# Altium schematic sheet Sheet1.SchDoc
size A
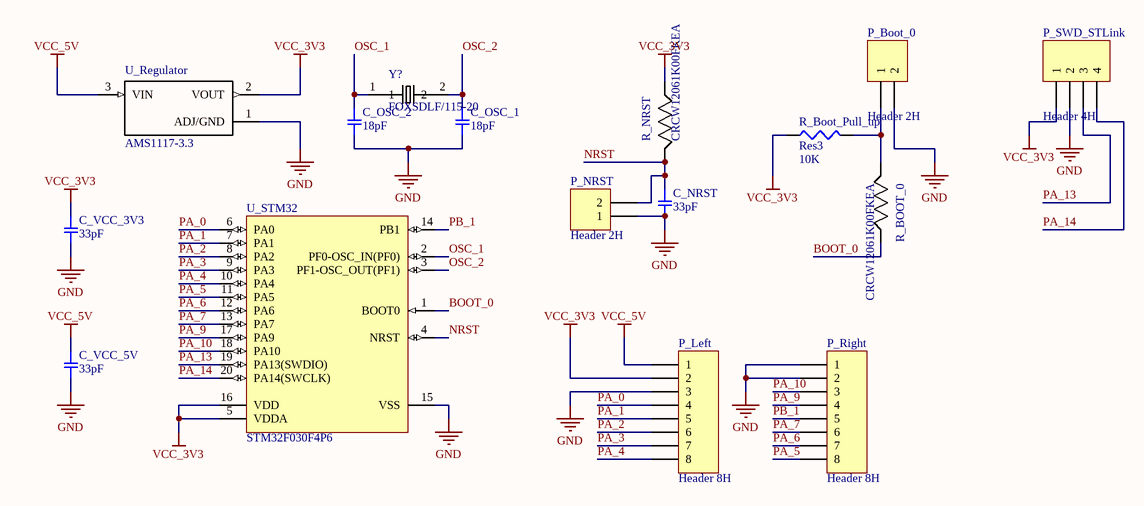
[diagram p0: Sheet1.SchDoc]

## Parts
C_NRST  33pF  [SMD-1206C]
C_OSC_1  18pF  [SMD-1206C]
C_OSC_2  18pF  [SMD-1206C]
C_VCC_3V3  33pF  [SMD-1206C]
C_VCC_5V  33pF  [SMD-1206C]
P_Boot_0  Header 2H  [HDR1X2H]
P_Left  Header 8H  [HDR1X8H]
P_NRST  Header 2H  [HDR1X2H]
P_Right  Header 8H  [HDR1X8H]
P_SWD_STLink  Header 4H  [HDR1X4H]
R_BOOT_0  CRCW12061K00FKEA  [RESC3216X65]
R_Boot_Pull_up  Res3  value 10K  [J1-0603]
R_NRST  CRCW12061K00FKEA  [RESC3216X65]
U_Regulator  AMS1117-3.3  [SOT229P700X180-4N]
U_STM32  STM32F030F4P6  [STM-TSSOP20_N]
Y?  FOXSDLF/115-20  [XTAL1170X500X450]

## Nets
GND: C_NRST.2 C_OSC_1.2 C_OSC_2.2 C_VCC_3V3.2 C_VCC_5V.2 P_Boot_0.2 P_Left.3 P_NRST.1 P_Right.1 P_Right.2 P_SWD_STLink.2 U_Regulator.1(ADJ/GND) U_STM32.15(VSS)
VCC_3V3: C_VCC_3V3.1 P_Left.2 P_SWD_STLink.1 R_Boot_Pull_up.1 R_NRST.2 U_Regulator.2(VOUT) U_STM32.5(VDDA) U_STM32.16(VDD)
VCC_5V: C_VCC_5V.1 P_Left.1 U_Regulator.3(VIN)
BOOT_0: R_BOOT_0.2 U_STM32.1(BOOT0)
NRST: C_NRST.1 P_NRST.2 R_NRST.1 U_STM32.4(NRST)
OSC_1: C_OSC_2.1 U_STM32.2(PF0-OSC_IN(PF0)) Y?.1
OSC_2: C_OSC_1.1 U_STM32.3(PF1-OSC_OUT(PF1)) Y?.2
PA_0: P_Left.4 U_STM32.6(PA0)
PA_1: P_Left.5 U_STM32.7(PA1)
PA_2: P_Left.6 U_STM32.8(PA2)
PA_3: P_Left.7 U_STM32.9(PA3)
PA_4: P_Left.8 U_STM32.10(PA4)
PA_5: P_Right.8 U_STM32.11(PA5)
PA_6: P_Right.7 U_STM32.12(PA6)
PA_7: P_Right.6 U_STM32.13(PA7)
PA_9: P_Right.4 U_STM32.17(PA9)
PA_10: P_Right.3 U_STM32.18(PA10)
PA_13: P_SWD_STLink.3 U_STM32.19(PA13(SWDIO))
PA_14: P_SWD_STLink.4 U_STM32.20(PA14(SWCLK))
PB_1: P_Right.5 U_STM32.14(PB1)
NetP_Boot_0_1: P_Boot_0.1 R_BOOT_0.1 R_Boot_Pull_up.2

## Library data of the parts
C_NRST C_OSC_1 C_OSC_2 C_VCC_3V3 C_VCC_5V = GC331AD72E333KX01D: CAP CER 0.033UF 250V X7T 1206; Manufacturer: Murata Electronics North America; Factory Stock: 0; Unit Price (USD): 0.33; Minimum Quantity: 1; Tolerance: ±10%; Datasheets: http://search.murata.co.jp/Ceramy/image/img/A01X/G101/ENG/GC331AD72E333KX01-01.pdf; Image: //media.digikey.com/Renders/Murata%20Renders/1206(GC3)320x160.jpg; Digi-Key Part Number: 490-13989-1-ND; Part Number: GC331AD72E333KX01D; Quantity Available: 3999; @ qty: 0; Packaging: Cut Tape (CT); Series: GC3; Part Status: Active; Voltage: 250V; Temperature Coefficient: X7T; Operating Temperature: -55°C ~ 125°C; Features: -; Ratings: AEC-Q200; Applications: Automotive; Mounting Type: Surface Mount, MLCC; Package / Case: 1206 (3216 Metric); Size / Dimension: 0.126" L x 0.063" W (3.20mm x 1.60mm); Height - Seated (Max): -; Thickness (Max): 0.039" (1.00mm); Lead Spacing: -; Lead Style: -
  C_NRST C_VCC_3V3 C_VCC_5V: Value: 33pF
  C_OSC_1 C_OSC_2: Value: 18pF
P_Boot_0 P_NRST = Header 2H: Header, 2-Pin, Right Angle; LatestRevisionDate: 17-Jul-2002; LatestRevisionNote: Re-released for DXP Platform.; Publisher: Altium Limited
P_Left P_Right = Header 8H: Header, 8-Pin, Right Angle; LatestRevisionDate: 17-Jul-2002; LatestRevisionNote: Re-released for DXP Platform.; Publisher: Altium Limited
P_SWD_STLink = Header 4H: Header, 4-Pin, Right Angle; LatestRevisionDate: 17-Jul-2002; LatestRevisionNote: Re-released for DXP Platform.; Publisher: Altium Limited
R_BOOT_0 = CRCW12061K00FKEA: Res Thick Film 1206 1K Ohm 1% 0.25W_1/4W_ Â±100ppm/C Molded SMD Automotive Paper T/R; MF: Vishay; Value: 10K; Package: 1206 Vishay; Availability: Good; SnapEDA_Link: https://www.snapeda.com/parts/CRCW12061K00FKEA/Vishay%20Dale/view-part/?ref=snap; Price: 0.03 USD; MP: CRCW12061K00FKEA
R_Boot_Pull_up = Res3: Resistor; Published: 8-Jun-2000; LatestRevisionDate: 29-May-2009; LatestRevisionNote: IPC-7351 Footprint Added.; PackageReference: J1-0603; Publisher: Altium Limited; PackageDescription: Chip Resistor
R_NRST = CRCW12061K00FKEA: Res Thick Film 1206 1K Ohm 1% 0.25W_1/4W_ Â±100ppm/C Molded SMD Automotive Paper T/R; MF: Vishay; Package: 1206 Vishay; Availability: Good; SnapEDA_Link: https://www.snapeda.com/parts/CRCW12061K00FKEA/Vishay%20Dale/view-part/?ref=snap; Price: 0.03 USD; MP: CRCW12061K00FKEA; Value: *
U_Regulator = AMS1117-3.3: Sot223/Pkg 1-Amp 3.3-Volt Low Drop Out Voltage Regulatator; MF: Advanced Monolithic Systems; MP: AMS1117-3.3; Availability: Unavailable; Package: None; Price: None; SnapEDA_Link: https://www.snapeda.com/parts/AMS1117-3.3/Advanced%20Monolithic%20Systems/view-part/?ref=snap; Value: *
U_STM32 = STM32F030F4P6: ARM Cortex-M0 32-bit MCU, 16 KB Flash, 4 KB Internal RAM, 15 I/Os, 20-pin TSSOP, -40 to 85 degC, Tube; FLASH Size (Prog) (kB): 16; I/Os (High Current): 15; Internal RAM Size (kB): 4; Operating Frequency(F) (Processor speed) (MHz): 48; Supply Voltage(Vcc) min (V): 2.4; DatasheetVersion: Rev. 1; PackageVersion: Rev. 1, 11/2012; PackageReference: TSSOP20; PackageDescription: 20-Pin Thin Shrink Small Outline Package, 6.5 x 4.4 mm Body, 0.65 mm Pitch; Supplier 1: Digi-Key; Supplier Part Number 1: 497-14044-5-ND; Supplier 2: Newark; Supplier Part Number 2: 06X3648; Supplier 3: Mouser; Supplier Part Number 3: 511-STM32F030F4P6; Core: ARM Cortex-M0; Packing: Tube; Mounting Technology: Surface Mount; PartNumber: STM32F030F4P6; ComponentLink1Description: Manufacturer URL; ComponentLink1URL: http://www.st.com/web/en/home.html; ComponentLink2Description: Datasheet; ComponentLink2URL: http://www.st.com/st-web-ui/static/active/en/resource/technical/document/datasheet/DM00088500.pdf; ComponentLink3Description: Package Specification; ComponentLink3URL: http://www.st.com/st-web-ui/static/active/en/resource/technical/document/datasheet/DM00065136.pdf
Y? = FOXSDLF/115-20: Crystal 11.0592MHz ?30ppm _Tol_ ?50ppm _Stability_ 20pF FUND 60Ohm 2-Pin HC-49/SDLF SMD T/R; MF: Fox Electronics; MP: FOXSDLF/115-20; Availability: Good; Package: HC49SD Fox Electronics; Price: 0.34 USD; SnapEDA_Link: https://www.snapeda.com/parts/FOXSDLF/115-20/Fox%20Electronics/view-part/?ref=snap; Value: *